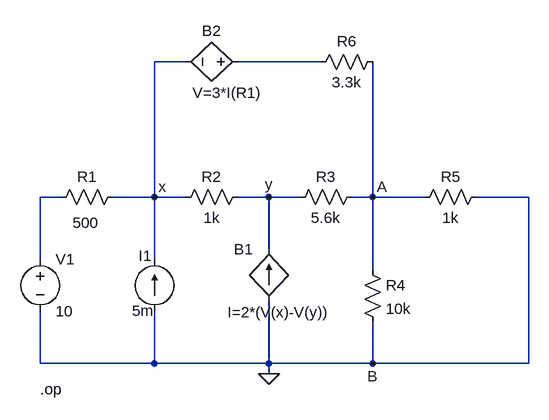
[diagram p0: schematic isc.asc]
isc.asc, the LTspice schematic file:
Version 4
SHEET 1 880 680
WIRE 320 -48 272 -48
WIRE 528 -48 400 -48
WIRE 128 160 96 160
WIRE 272 160 272 -48
WIRE 272 160 208 160
WIRE 320 160 272 160
WIRE 448 160 400 160
WIRE 496 160 448 160
WIRE 608 160 608 -48
WIRE 608 160 576 160
WIRE 688 160 608 160
WIRE 848 160 768 160
WIRE 448 240 448 160
WIRE 96 256 96 160
WIRE 272 256 272 160
WIRE 608 272 608 160
WIRE 96 416 96 336
WIRE 272 416 272 336
WIRE 272 416 96 416
WIRE 448 416 448 320
WIRE 448 416 272 416
WIRE 608 416 608 352
WIRE 608 416 448 416
WIRE 848 416 848 160
WIRE 848 416 608 416
WIRE 448 432 448 416
FLAG 448 432 0
FLAG 608 416 B
FLAG 272 160 x
FLAG 448 160 y
FLAG 608 160 A
SYMBOL res 224 144 R90
WINDOW 0 0 56 VBottom 2
WINDOW 3 40 58 VTop 2
SYMATTR InstName R1
SYMATTR Value 500
SYMBOL res 416 144 R90
WINDOW 0 0 56 VBottom 2
WINDOW 3 32 56 VTop 2
SYMATTR InstName R2
SYMATTR Value 1k
SYMBOL res 592 144 R90
WINDOW 0 0 56 VBottom 2
WINDOW 3 32 56 VTop 2
SYMATTR InstName R3
SYMATTR Value 5.6k
SYMBOL res 592 256 R0
SYMATTR InstName R4
SYMATTR Value 10k
SYMBOL res 672 176 R270
WINDOW 0 32 56 VTop 2
WINDOW 3 0 56 VBottom 2
SYMATTR InstName R5
SYMATTR Value 1k
SYMBOL voltage 96 240 R0
WINDOW 123 0 0 Left 0
WINDOW 39 0 0 Left 0
SYMATTR InstName V1
SYMATTR Value 10
SYMBOL current 272 336 R180
WINDOW 0 4 86 Left 2
WINDOW 3 1 1 Left 2
SYMATTR InstName I1
SYMATTR Value 5m
SYMBOL res 624 -64 R90
WINDOW 0 0 56 VBottom 2
WINDOW 3 32 56 VTop 2
SYMATTR InstName R6
SYMATTR Value 3.3k
SYMBOL bi 448 320 R180
WINDOW 0 24 80 Left 2
WINDOW 3 -93 -17 Left 2
SYMATTR InstName B1
SYMATTR Value I=2*(V(x)-V(y))
SYMBOL bv 416 -48 R90
WINDOW 0 -32 56 VBottom 2
WINDOW 3 32 32 VTop 2
SYMATTR InstName B2
SYMATTR Value V=3*I(R1)
TEXT 96 456 Left 2 !.op

The netlist it stands for:
* isc.asc
R1 x N002 500
R2 y x 1k
R3 A y 5.6k
R4 A 0 10k
R5 A 0 1k
V1 N002 0 10
I1 0 x 5m
R6 A N001 3.3k
B1 0 y I=2*(V(x)-V(y))
B2 N001 x V=3*I(R1)
.op
.backanno
.end